# EAGLE schematic Main (EAGLE 8.4.0)
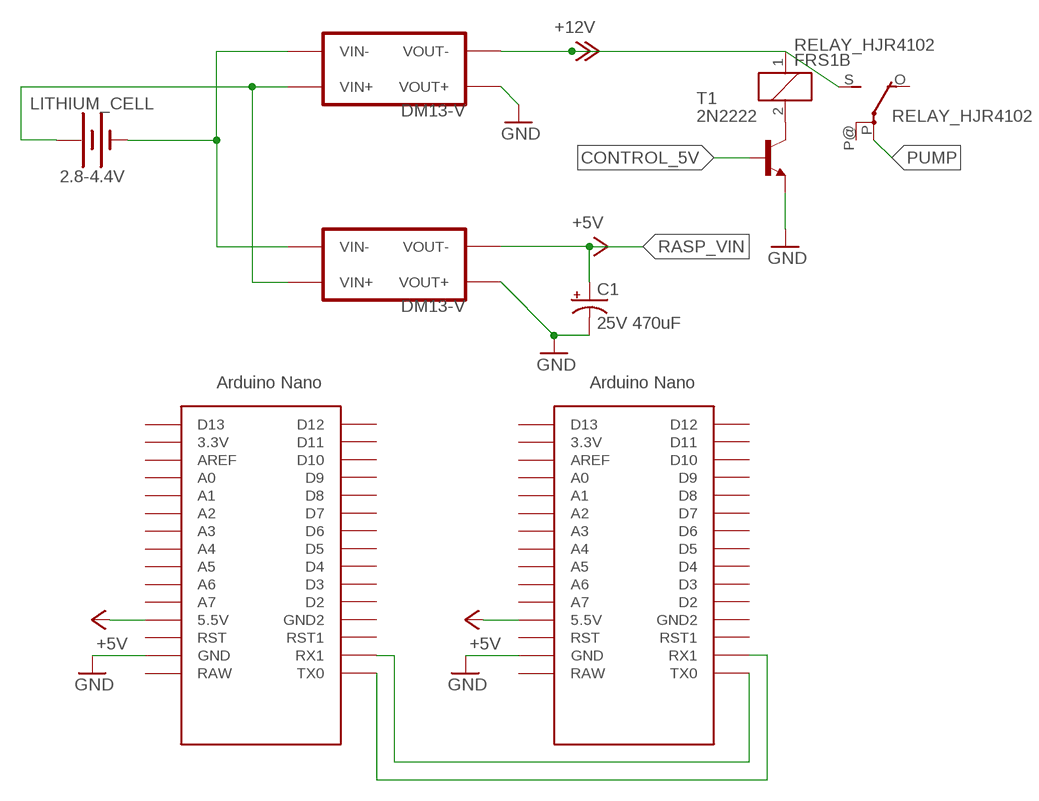
[diagram p0: schematic, sheet 1]

## Parts
C1  25V 470uF  CPOL-USE2,5-6E  [E2,5-6E]
DM1  DM13-V5  [DM13-V5]
DM2  NANO  [NANO]
DM3  NANO  [NANO]
DM13-V12  DM13-V12  [DM13-V12]
LITHIUM_CELL  2.8-4.4V  BATTERY-18650  [BATTERY_18650-HOLDER]
RELAY_HJR4102  FRS1B  [FRS1B]
T1  2N2222  [TO92-EBC-OVAL]

## Nets
+5V: DM2.5V(5.5V) DM3.5V(5.5V)
+12V: DM13-V12.VOUT- RELAY_HJR4102.1
CONTROL_5V: T1.B
GND: C1.- DM1.VOUT+ DM2.GND DM3.GND DM13-V12.VOUT+ T1.E
N$1: DM1.VIN+ DM13-V12.VIN+ LITHIUM_CELL.PWR@1(+)
N$2: DM1.VIN- DM13-V12.VIN- LITHIUM_CELL.GND@1(-)
N$3: DM2.RX1 DM3.TX0
N$4: DM2.TX0 DM3.RX1
N$5: RELAY_HJR4102.2 T1.C
N$6: RELAY_HJR4102.S(2:S)
PUMP: RELAY_HJR4102.P(2:P)
RASP_VIN: C1.+ DM1.VOUT- ; supply symbol labelled +5V
Unconnected: DM2.3.3V DM2.A0 DM2.A1 DM2.A2 DM2.A3 DM2.A4 DM2.A5 DM2.A6 DM2.A7 DM2.AREF DM2.D2 DM2.D3 DM2.D4 DM2.D5 DM2.D6 DM2.D7 DM2.D8 DM2.D9 DM2.D10 DM2.D11 DM2.D12 DM2.D13 DM2.GND1(GND2) DM2.ICSP1 DM2.ICSP2 DM2.ICSP3 DM2.ICSP4 DM2.ICSP5 DM2.ICSP6 DM2.RAW DM2.RST DM2.RST1 DM3.3.3V DM3.A0 DM3.A1 DM3.A2 DM3.A3 DM3.A4 DM3.A5 DM3.A6 DM3.A7 DM3.AREF DM3.D2 DM3.D3 DM3.D4 DM3.D5 DM3.D6 DM3.D7 DM3.D8 DM3.D9 DM3.D10 DM3.D11 DM3.D12 DM3.D13 DM3.GND1(GND2) DM3.ICSP1 DM3.ICSP2 DM3.ICSP3 DM3.ICSP4 DM3.ICSP5 DM3.ICSP6 DM3.RAW DM3.RST DM3.RST1 RELAY_HJR4102.O(2:O) RELAY_HJR4102.P@(2:P)

## Library data of the parts
C1 = adafruit:CPOL-US: POLARIZED CAPACITOR, American symbol
DM1 = externalCircuits:DM13-V5: DM13-V5 5V step-up converter circuit 12V http://eleparts.co.kr/EPXHLFXK 5V http://eleparts.co.kr/EPXHLFXJ
DM2 DM3 = Arduino-clone:NANO: Arduino Nano
DM13-V12 = externalCircuits:DM13-V12: DM13-V12 12V step-up converter circuit 12V http://eleparts.co.kr/EPXHLFXK 5V http://eleparts.co.kr/EPXHLFXJ
LITHIUM_CELL = SparkFun-Batteries:BATTERY: Battery - Single Cell A variety of battery chemistries, sizes, and footprints. Device List: 20MM_PTH - Coin Cell Battery Holder - 20mm (PTH) <https://www.sparkfun.com/products/783> 6.8MM_PTH - Coin Cell Battery Holder - 6.8MM(SMD) <https://www.digikey.com/product-detail/en/seiko-instruments/MS621FE-FL11E/728-1057-ND/1889208?WT.srch=1&gclid=CNOQ5a6LzdQCFZS2wAodXCkE0g> 12MM_SMD - Coin Cell Battery Holder - 12mm (SMD) <https://www.sparkfun.com/products/10592> 12MM_PTH - Coin Cell Battery Holder - 12mm (PTH) <https://www.sparkfun.com/products/7948> 20MM_SMD - 20mm Coin Cell Battery Holder (SMD) (2 legs) Used on the Big Time Watch Kit <https://www.sparkfun.com/products/11734> 20MM_SMD_4LEGS - Coin Cell Battery Holder - 20mm (SMD) <https://www.sparkfun.com/products/11892> 20MM_SMD_4LEGS_OVERPASTE - Coin Cell Battery Holder - 20mm (SMD) <https://www.sparkfun.com/products/11892> (Over-paste on the legs) 24.5MM_PTH - Coin Cell Battery Holder - 24.5mm (PTH) <https://www.sparkfun.com/products/8863> 9V - 9V Battery Holder - PC Mount Used on the SparkFun SparkPunk Sound Kit <https://www.sparkfun.com/products/11177> and SparkFun SparkPunk Sequencer Kit <https://www.sparkfun.com/products/12707> 18650 - Battery Holder - 18650 (PTH) <https://www.sparkfun.com/products/13113> AA - Battery Holder - 1xAA (PTH) <https://www.sparkfun.com/products/7949> AAA - Battery Holder - 1xAAA (PTH) <https://www.sparkfun.com/products/12718> AA_KIT - Battery Holder - 1xAA (PTH) <https://www.sparkfun.com/products/7949> Special kit package - pads only have exposed copper on one side of the board. AAA_KIT - Battery Holder - 1xAAA (PTH) <https://www.sparkfun.com/products/12718> Special kit package - pads only have exposed copper on one side of the board.; PROD_ID: BATT-12327; SF_SKU: PRT-13113
RELAY_HJR4102 = relay:FRS1B: RELAY 1 x switch, same as V23101-D6-A201, Siemens; OC_FARNELL: unknown; OC_NEWARK: unknown
T1 = adafruit:2N2222: NPN TRANSISTOR Big oval pads